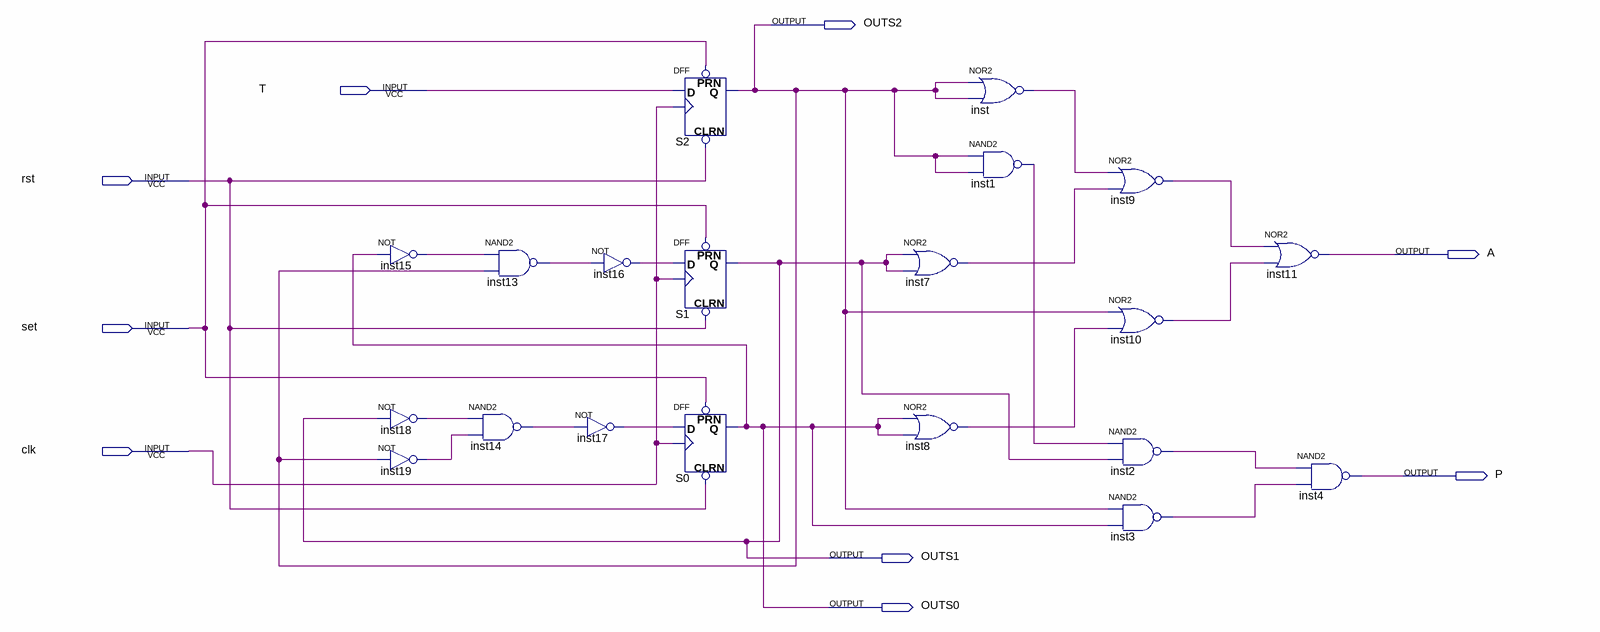
[diagram p0: schematic sheet]
// Quartus schematic lab7.bdf as structural Verilog: 20 symbols, 9 pins
module lab7 (
  input  T,
  input  rst,
  input  set,
  input  clk,
  output OUTS2,
  output A,
  output P,
  output OUTS1,
  output OUTS0
);

  wire inst1_out, inst2_out, inst3_out, inst7_out, inst8_out, inst9_out, inst10_out, inst13_out, inst14_out,
       inst15_out, inst16_out, inst17_out, inst18_out, inst19_out, inst_out;

  not inst15 (inst15_out, OUTS0);
  not inst18 (inst18_out, OUTS1);
  not inst19 (inst19_out, OUTS2);
  nand inst13 (inst13_out, inst15_out, OUTS2);
  nand inst14 (inst14_out, inst18_out, inst19_out);
  not inst16 (inst16_out, inst13_out);
  not inst17 (inst17_out, inst14_out);
  DFF S2 (.CLRN(rst), .CLK(clk), .D(T), .PRN(set), .Q(OUTS2));
  DFF S1 (.CLRN(rst), .CLK(clk), .D(inst16_out), .PRN(set), .Q(OUTS1));
  DFF S0 (.CLRN(rst), .CLK(clk), .D(inst17_out), .PRN(set), .Q(OUTS0));
  nor inst7 (inst7_out, OUTS1, OUTS1);
  nor inst8 (inst8_out, OUTS0, OUTS0);
  nor inst (inst_out, OUTS2, OUTS2);
  nand inst1 (inst1_out, OUTS2, OUTS2);
  nor inst9 (inst9_out, inst_out, inst7_out);
  nor inst10 (inst10_out, OUTS2, inst8_out);
  nand inst2 (inst2_out, inst1_out, OUTS1);
  nand inst3 (inst3_out, OUTS2, OUTS0);
  nor inst11 (A, inst9_out, inst10_out);
  nand inst4 (P, inst2_out, inst3_out);
endmodule
